# EAGLE design Layer3 (EAGLE 9.6.1)

## Sheet 1 of 2
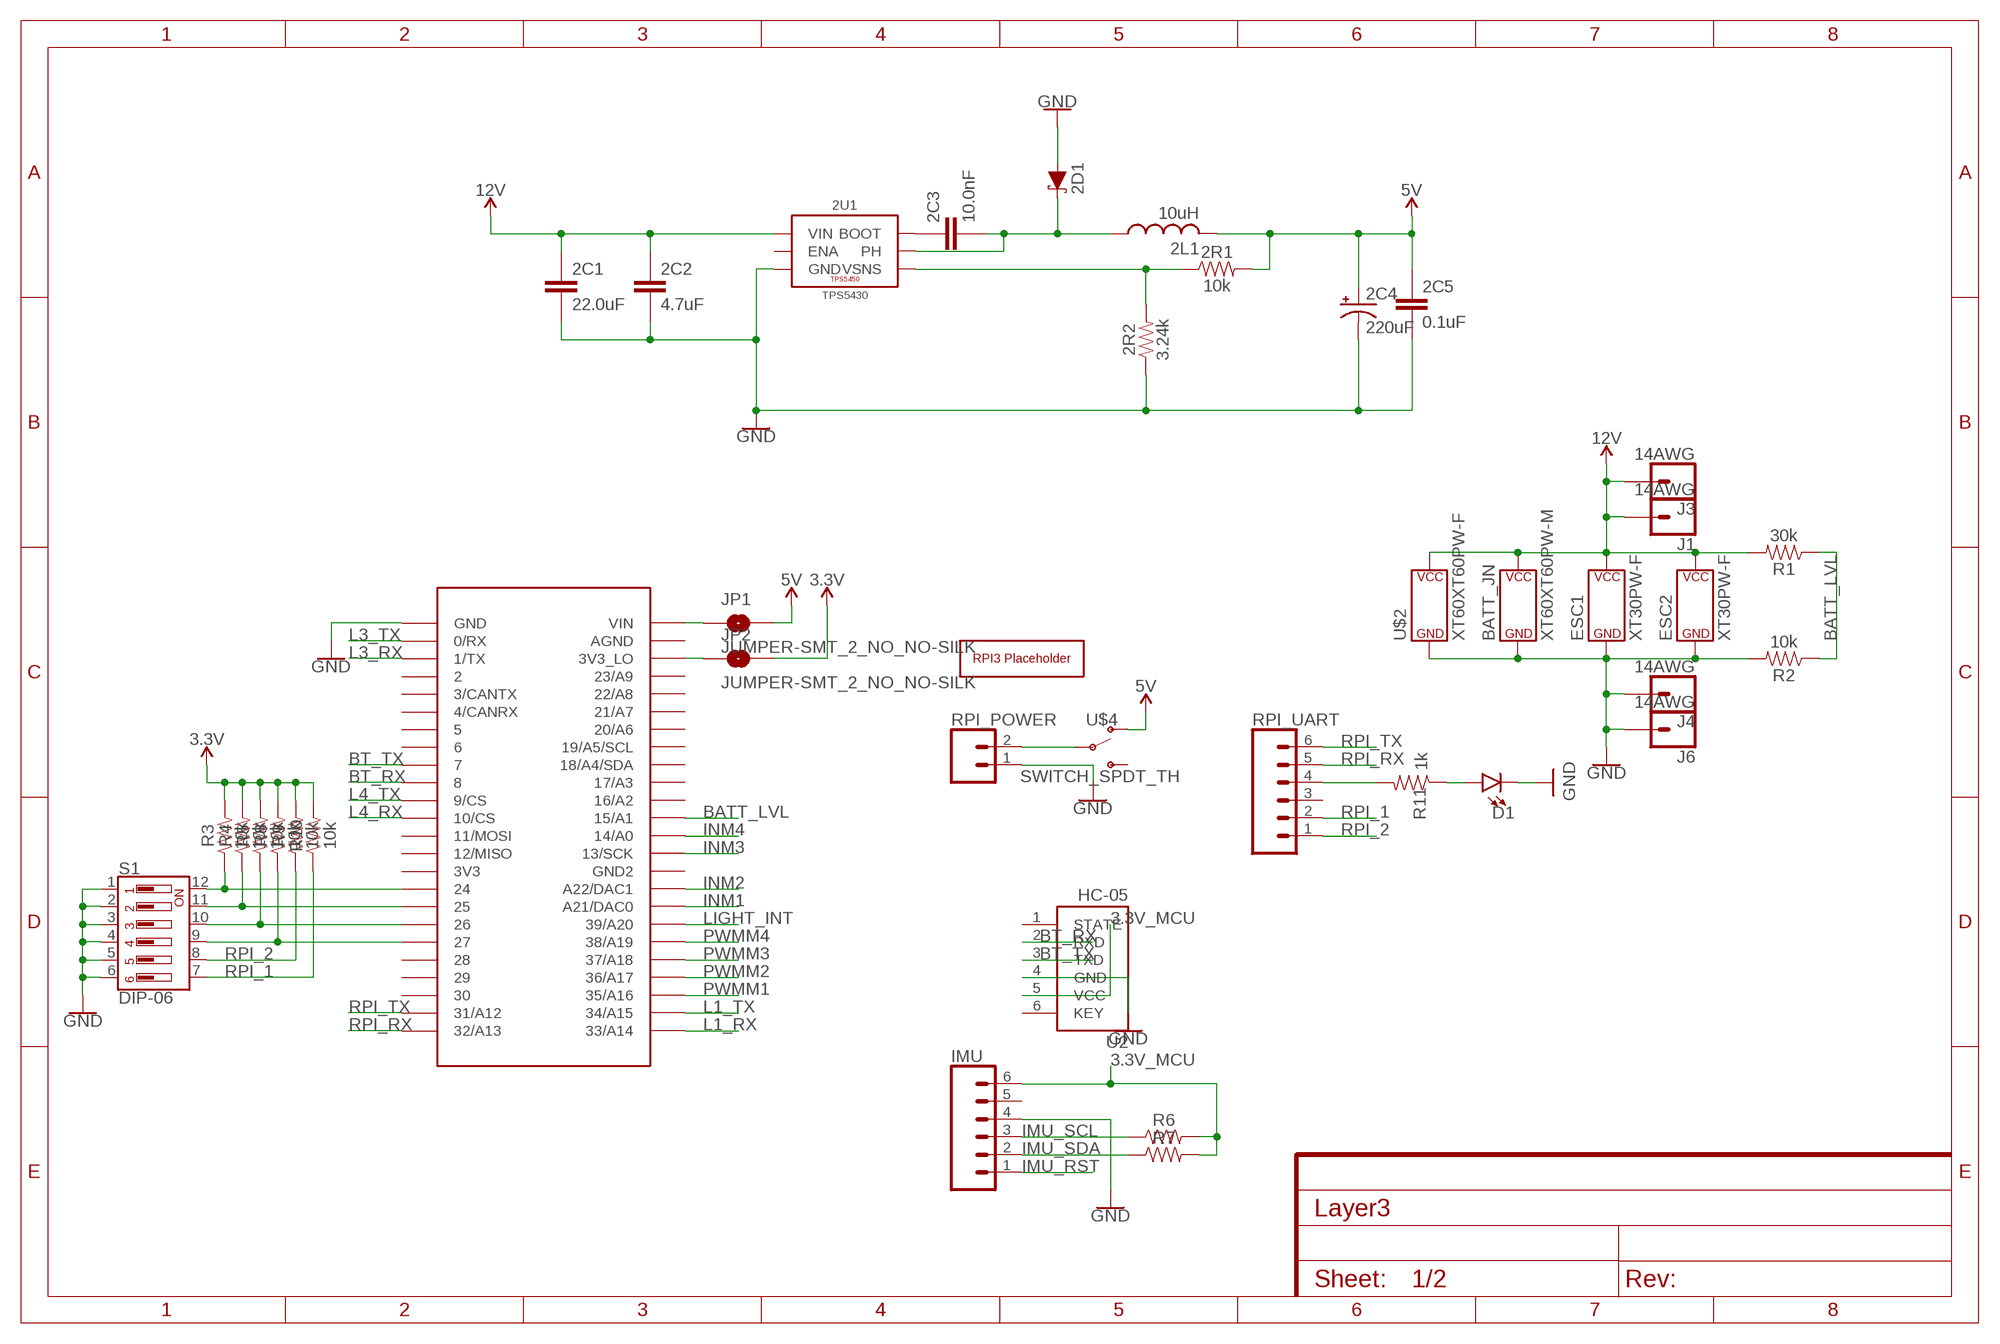
[diagram p0: schematic, sheet 1]

### Parts
2C1  22.0uF  CAPACITOR1210  [C1210]
2C2  4.7uF  CAPACITOR0603  [C0603]
2C3  10.0nF  CAPACITOR0603  [C0603]
2C4  220uF  CPOL-USD/7343-31R  [D/7343-31R]
2C5  0.1uF  CAPACITOR0603  [C0603]
2D1  3A/40V/500mV  DIODE-SCHOTTKY  [SMA-DIODE]
2L1  10uH  INDUCTORSWPA8040  [SWPA8040]
2R1  10k  RESISTOR0603  [R0603]
2R2  3.24k  RESISTOR0603  [R0603]
2U1  TPS5430  TPS5450  [POWERPAD-SOIC-8]
BATT_JN  XT60XT60PW-M  [XT60PW-M]
D1  BLUE  LED0603  [LED-0603]
ESC1  XT30PW-F  [XT30PW-F]
ESC2  XT30PW-F  [XT30PW-F]
IMU  CONN_06FEMALE_LOCK  [1X06_FEMALE_LOCK.010]
J1  14AWG  [14AWG]
J3  14AWG  [14AWG]
J4  14AWG  [14AWG]
J6  14AWG  [14AWG]
JP1  JUMPER-SMT_2_NO_NO-SILK  [SMT-JUMPER_2_NO_NO-SILK]
JP2  JUMPER-SMT_2_NO_NO-SILK  [SMT-JUMPER_2_NO_NO-SILK]
PCB1  RPI3  [RPI3]
R1  30k  RESISTOR0603  [R0603]
R2  10k  RESISTOR0603  [R0603]
R3  10k  RESISTOR0603  [R0603]
R4  10k  RESISTOR0603  [R0603]
R5  10k  RESISTOR0603  [R0603]
R6  RESISTOR0603  [R0603]
R7  RESISTOR0603  [R0603]
R8  10k  RESISTOR0603  [R0603]
R9  10k  RESISTOR0603  [R0603]
R10  10k  RESISTOR0603  [R0603]
R11  1k  RESISTOR0603  [R0603]
RPI_POWER  CONN_02LOCK  [1X02_LOCK]
RPI_UART  CONN_06LOCK  [1X06_LOCK]
S1  DIP-06  [DIPSWITCH-06-SMD]
U2  HC-05_BENT  [HC-05_BENT]
U$1  TEENSY_3.5/3.6_NO_MIDDLE  [TEENSY_3.5/3.6_NO_MIDDLE]
U$2  XT60XT60PW-F  [XT60PW-F]
U$4  SWITCH_SPDT_TH  [SWITCH_SPDT_PTH_11.6X4.0MM_LOCK]

### Nets
3.3V: JP2.2 R3.2 R4.2 R5.2 R8.2 R9.2 R10.2 ; also sheet 2
3.3V_MCU: IMU.6 R6.2 R7.2 U2.5(VCC) ; also sheet 2
5V: 2C4.+ 2C5.1 2L1.P2 2R1.2 JP1.2 U$4.1(O) ; also sheet 2
12V: 2C1.1 2C2.1 2U1.7(VIN) BATT_JN.+(P$V+) ESC1.+(P$V+) ESC2.+(P$V+) J1.P$1 J3.P$1 R1.2 U$2.+(P$V+)
BATT_LVL: R1.1 R2.1 U$1.15/A1
BT_RX: U2.2(RXD) U$1.8
BT_TX: U2.3(TXD) U$1.7
GND: 2C1.2 2C2.2 2C4.- 2C5.2 2D1.A 2R2.1 2U1.6(GND) 2U1.9(GND) 2U1.P$1(GND) 2U1.P$2(GND) 2U1.P$3(GND) 2U1.P$4(GND) 2U1.P$5(GND) 2U1.P$6(GND) BATT_JN.-(P$V-) D1.C ESC1.-(P$V-) ESC2.-(P$V-) IMU.4 J4.P$1 J6.P$1 R2.2 RPI_POWER.1 S1.1 S1.2 S1.3 S1.4 S1.5 S1.6 U2.4(GND) U$1.GND U$2.-(P$V-) ; also sheet 2
IMU_RST: IMU.1 ; also sheet 2
IMU_SCL: IMU.3 R6.1 ; also sheet 2
IMU_SDA: IMU.2 R7.1 ; also sheet 2
INM1: U$1.A21/DAC0 ; also sheet 2
INM2: U$1.A22/DAC1 ; also sheet 2
INM3: U$1.13/SCK ; also sheet 2
INM4: U$1.14/A0 ; also sheet 2
L1_RX: U$1.33/A14 ; also sheet 2
L1_TX: U$1.34/A15 ; also sheet 2
L3_RX: U$1.1/TX ; also sheet 2
L3_TX: U$1.0/RX ; also sheet 2
L4_RX: U$1.10/CS ; also sheet 2
L4_TX: U$1.9/CS ; also sheet 2
LIGHT_INT: U$1.39/A20 ; also sheet 2
N$1: JP1.1 U$1.VIN
N$2: JP2.1 U$1.3V3_LO
N$5: R4.1 S1.11 U$1.25
N$6: 2C3.2 2D1.C 2L1.P1 2U1.8(PH)
N$7: 2R1.1 2R2.2 2U1.4(VSNS)
N$8: 2C3.1 2U1.1(BOOT)
N$9: RPI_POWER.2 U$4.2(P)
N$10: R3.1 S1.12 U$1.24
N$11: R5.1 S1.10 U$1.26
N$12: R8.1 S1.9 U$1.27
N$13: R11.2 RPI_UART.4
N$14: D1.A R11.1
PWMM1: U$1.35/A16 ; also sheet 2
PWMM2: U$1.36/A17 ; also sheet 2
PWMM3: U$1.37/A18 ; also sheet 2
PWMM4: U$1.38/A19 ; also sheet 2
RPI_1: R10.1 RPI_UART.2 S1.7
RPI_2: R9.1 RPI_UART.1 S1.8
RPI_RX: RPI_UART.5 U$1.32/A13
RPI_TX: RPI_UART.6 U$1.31/A12
Unconnected: 2U1.2(NC) 2U1.3(NC) 2U1.5(ENA) IMU.5 RPI_UART.3 U2.1(STATE) U2.6(KEY) U$1.2 U$1.3/CANTX U$1.3V3 U$1.4/CANRX U$1.5 U$1.6 U$1.11/MOSI U$1.12/MISO U$1.16/A2 U$1.17/A3 U$1.18/A4/SDA U$1.19/A5/SCL U$1.20/A6 U$1.21/A7 U$1.22/A8 U$1.23/A9 U$1.28 U$1.29 U$1.30 U$1.AGND U$1.GND2 U$4.3(S)

## Sheet 2 of 2
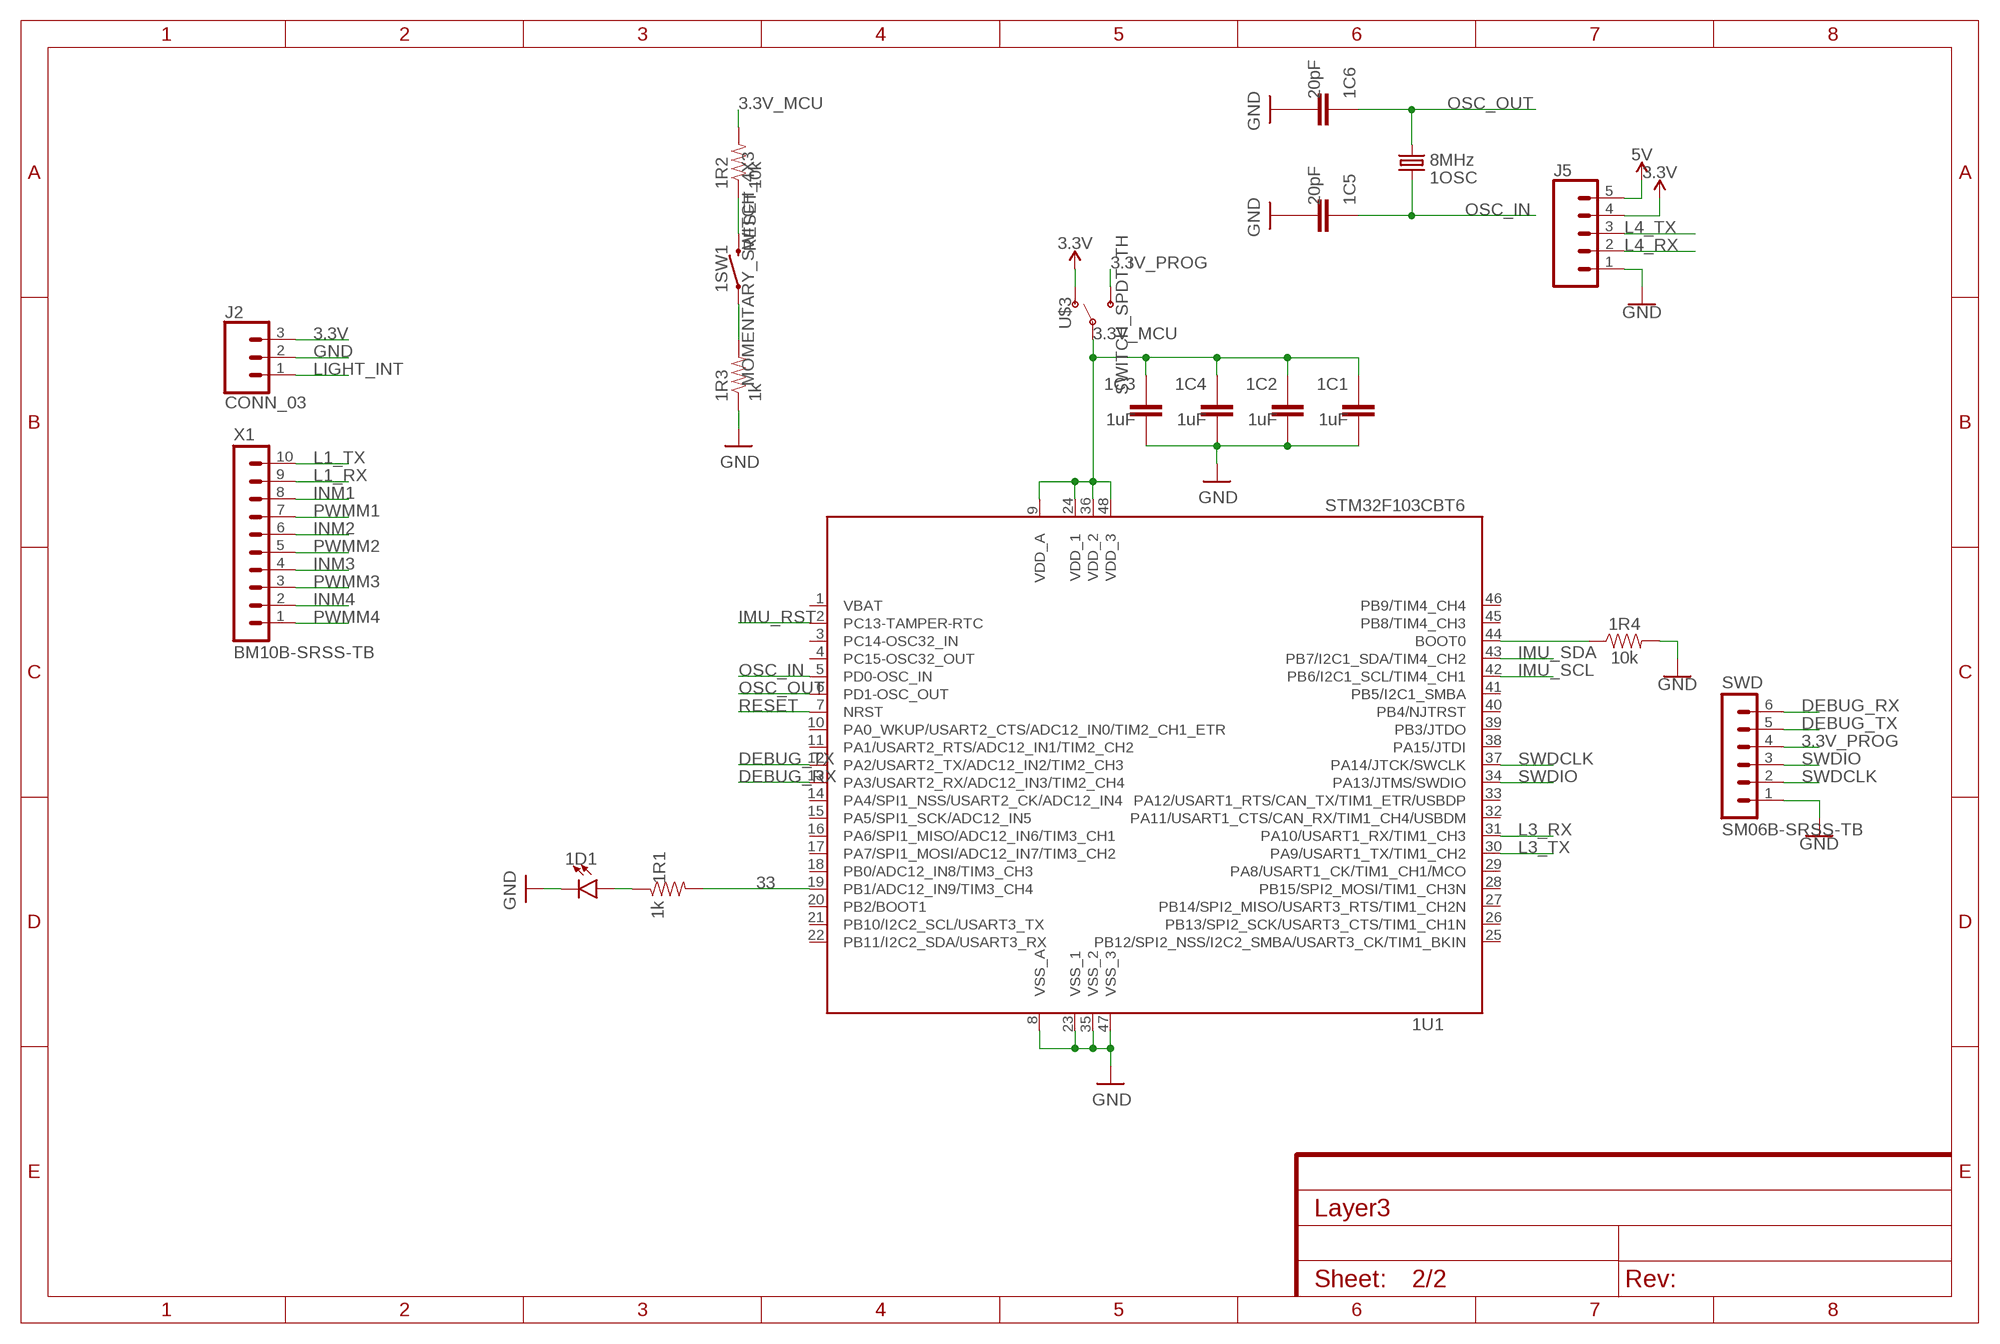
[diagram p1: schematic, sheet 2]

### Parts
1C1  1uF  CAPACITOR0603  [C0603]
1C2  1uF  CAPACITOR0603  [C0603]
1C3  1uF  CAPACITOR0603  [C0603]
1C4  1uF  CAPACITOR0603  [C0603]
1C5  20pF  CAPACITOR0603  [C0603]
1C6  20pF  CAPACITOR0603  [C0603]
1D1  BLUE  LED0603  [LED-0603]
1OSC  8MHz  CRYSTAL_5032  [CRYSTAL-SMD-5X3.2-2PAD]
1R1  1k  RESISTOR0603  [R0603]
1R2  10k  RESISTOR0603  [R0603]
1R3  1k  RESISTOR0603  [R0603]
1R4  10k  RESISTOR0603  [R0603]
1SW1  MOMENTARY_SWITCH_4X3  [MOMENTARY_SWITCH_4X3]
1U1  STM32F103CBT6  [LQFP48]
J2  CONN_03  [1X03_LOCK]
J5  CONN_05LOCK  [1X05_LOCK]
SWD  SM06B-SRSS-TB  [SM06B-SRSS-TB]
U$3  SWITCH_SPDT_TH  [SWITCH_SPDT_PTH_11.6X4.0MM_LOCK]
X1  BM10B-SRSS-TB  [BM10B-SRSS-TB]

### Nets
3.3V: J2.3 J5.4 U$3.1(O) ; also sheet 1
3.3V_MCU: 1C1.1 1C2.1 1C3.1 1C4.1 1R2.2 1U1.9(VDD_A) 1U1.24(VDD_1) 1U1.36(VDD_2) 1U1.48(VDD_3) U$3.2(P) ; also sheet 1
3.3V_PROG: SWD.4 U$3.3(S)
5V: J5.5 ; also sheet 1
33: 1R1.2 1U1.19(PB1/ADC12_IN9/TIM3_CH4)
DEBUG_RX: 1U1.13(PA3/USART2_RX/ADC12_IN3/TIM2_CH4) SWD.6
DEBUG_TX: 1U1.12(PA2/USART2_TX/ADC12_IN2/TIM2_CH3) SWD.5
GND: 1C1.2 1C2.2 1C3.2 1C4.2 1C5.2 1C6.2 1D1.C 1R3.1 1R4.2 1U1.8(VSS_A) 1U1.23(VSS_1) 1U1.35(VSS_2) 1U1.47(VSS_3) J2.2 J5.1 SWD.1 ; also sheet 1
IMU_RST: 1U1.2(PC13-TAMPER-RTC) ; also sheet 1
IMU_SCL: 1U1.42(PB6/I2C1_SCL/TIM4_CH1) ; also sheet 1
IMU_SDA: 1U1.43(PB7/I2C1_SDA/TIM4_CH2) ; also sheet 1
INM1: X1.8 ; also sheet 1
INM2: X1.6 ; also sheet 1
INM3: X1.4 ; also sheet 1
INM4: X1.2 ; also sheet 1
L1_RX: X1.9 ; also sheet 1
L1_TX: X1.10 ; also sheet 1
L3_RX: 1U1.31(PA10/USART1_RX/TIM1_CH3) ; also sheet 1
L3_TX: 1U1.30(PA9/USART1_TX/TIM1_CH2) ; also sheet 1
L4_RX: J5.2 ; also sheet 1
L4_TX: J5.3 ; also sheet 1
LIGHT_INT: J2.1 ; also sheet 1
N$3: 1D1.A 1R1.1
N$4: 1R3.2 1SW1.P$1
N$23: 1R4.1 1U1.44(BOOT0)
OSC_IN: 1C5.1 1OSC.P$2 1U1.5(PD0-OSC_IN)
OSC_OUT: 1C6.1 1OSC.P$1 1U1.6(PD1-OSC_OUT)
PWMM1: X1.7 ; also sheet 1
PWMM2: X1.5 ; also sheet 1
PWMM3: X1.3 ; also sheet 1
PWMM4: X1.1 ; also sheet 1
RESET: 1R2.1 1SW1.P$2 1U1.7(NRST)
SWDCLK: 1U1.37(PA14/JTCK/SWCLK) SWD.2
SWDIO: 1U1.34(PA13/JTMS/SWDIO) SWD.3
Unconnected: 1U1.3(PC14-OSC32_IN) 1U1.4(PC15-OSC32_OUT) 1U1.10(PA0_WKUP/USART2_CTS/ADC12_IN0/TIM2_CH1_ETR) 1U1.11(PA1/USART2_RTS/ADC12_IN1/TIM2_CH2) 1U1.14(PA4/SPI1_NSS/USART2_CK/ADC12_IN4) 1U1.15(PA5/SPI1_SCK/ADC12_IN5) 1U1.16(PA6/SPI1_MISO/ADC12_IN6/TIM3_CH1) 1U1.17(PA7/SPI1_MOSI/ADC12_IN7/TIM3_CH2) 1U1.18(PB0/ADC12_IN8/TIM3_CH3) 1U1.20(PB2/BOOT1) 1U1.21(PB10/I2C2_SCL/USART3_TX) 1U1.22(PB11/I2C2_SDA/USART3_RX) 1U1.25(PB12/SPI2_NSS/I2C2_SMBA/USART3_CK/TIM1_BKIN) 1U1.26(PB13/SPI2_SCK/USART3_CTS/TIM1_CH1N) 1U1.27(PB14/SPI2_MISO/USART3_RTS/TIM1_CH2N) 1U1.28(PB15/SPI2_MOSI/TIM1_CH3N) 1U1.29(PA8/USART1_CK/TIM1_CH1/MCO) 1U1.32(PA11/USART1_CTS/CAN_RX/TIM1_CH4/USBDM) 1U1.33(PA12/USART1_RTS/CAN_TX/TIM1_ETR/USBDP) 1U1.38(PA15/JTDI) 1U1.39(PB3/JTDO) 1U1.40(PB4/NJTRST) 1U1.41(PB5/I2C1_SMBA) 1U1.45(PB8/TIM4_CH3) 1U1.46(PB9/TIM4_CH4)

## Power pins joined to a net without a drawn wire
VBAT: 1U1.1(VBAT)

## Library data of the parts
1C1-1C6 2C1-2C3 2C5 = JH:CAPACITOR
1D1 D1 = JH:LED: Blue SMD LED Used in manufacturing of various products at SparkFun Packages: 0603 - SMD 0603 package [Product Link] <http://www.digikey.com/product-detail/en/SMLE12BC7TT86/511-1589-2-ND/1641808> 1206 - SMD1206 package [Product Link] <http://www.digikey.com/product-detail/en/lite-on-inc/LTST-C150TBKT/160-1643-1-ND/573584> SparkFun Products: ESP8266 Thing-Dev Board <https://www.sparkfun.com/products/13711> RedBoard <https://www.sparkfun.com/products/12757>
1OSC = JH:CRYSTAL: Crystals (Generic) These are passive quartz crystals, which can be used as a clock source for a microcontroller. Crystal's are two-terminal devices. They require external "load" capacitors to generate an oscillating signal.
1R1-1R4 2R1 2R2 R1-R11 = JH:RESISTOR
1SW1 = JH:MOMENTARY_SWITCH_4X3
1U1 = JH:STM32F103CBT6
2C4 = rcl:CPOL-US: POLARIZED CAPACITOR, American symbol; SPICEPREFIX: C
2D1 = JH:DIODE-SCHOTTKY
2L1 = JH:INDUCTOR
2U1 = JH:TPS5450
BATT_JN U$2 = JH:XT60
ESC1 ESC2 = JH:XT30
IMU = SparkFun-Connectors:CONN_06: Multi connection point. Often used as Generic Header-pin footprint for 0.1 inch spaced/style header connections On any of the 0.1 inch spaced packages, you can populate with these: Break Away Headers - Straight <https://www.sparkfun.com/products/116> (PRT-00116) Break Away Male Headers - Right Angle <https://www.sparkfun.com/products/553> (PRT-00553) Female Headers <https://www.sparkfun.com/products/115> (PRT-00115) Break Away Headers - Machine Pin <https://www.sparkfun.com/products/117> (PRT-00117) Break Away Female Headers - Swiss Machine Pin <https://www.sparkfun.com/products/743> (PRT-00743) Arduino Stackable Header - 6 Pin <https://www.sparkfun.com/products/9280> (PRT-09280) For SCREWTERMINALS and SPRING TERMINALS visit here: Screw Terimnals on SparkFun.com <https://www.sparkfun.com/search/results?term=Screw+Terminals> (5mm/3.5mm/2.54mm spacing) This device is also useful as a general connection point to wire up your design to another part of your project. Our various solder wires solder well into these plated through hole pads. Hook-Up Wire - Assortment (Stranded, 22 AWG) <https://www.sparkfun.com/products/11375> (PRT-11375) Hook-Up Wire - Assortment (Solid Core, 22 AWG) <https://www.sparkfun.com/products/11367> (PRT-11367) View the entire wire category on our website here <https://www.sparkfun.com/categories/141>
J1 J3 J4 J6 = JH:14AWG
J2 = JH:CONN_03
J5 = Connectors:CONN_05: Multi connection point. Often used as Generic Header-pin footprint for 0.1 inch spaced/style header connections On any of the 0.1 inch spaced packages, you can populate with these: Break Away Headers - Straight <https://www.sparkfun.com/products/116> (PRT-00116) Break Away Male Headers - Right Angle <https://www.sparkfun.com/products/553> (PRT-00553) Female Headers <https://www.sparkfun.com/products/115> (PRT-00115) Break Away Headers - Machine Pin <https://www.sparkfun.com/products/117> (PRT-00117) Break Away Female Headers - Swiss Machine Pin <https://www.sparkfun.com/products/743> (PRT-00743) For SCREWTERMINALS and SPRING TERMINALS visit here: Screw Terimnals on SparkFun.com <https://www.sparkfun.com/search/results?term=Screw+Terminals> (5mm/3.5mm/2.54mm spacing) This device is also useful as a general connection point to wire up your design to another part of your project. Our various solder wires solder well into these plated through hole pads. Hook-Up Wire - Assortment (Stranded, 22 AWG) <https://www.sparkfun.com/products/11375> (PRT-11375) Hook-Up Wire - Assortment (Solid Core, 22 AWG) <https://www.sparkfun.com/products/11367> (PRT-11367) View the entire wire category on our website here <https://www.sparkfun.com/categories/141> Special notes: Molex polarized connector foot print use with SKU : PRT-08231 with associated crimp pins and housings. 1MM SMD Version SKU: PRT-10208
JP1 JP2 = SparkFun-Jumpers:JUMPER-SMT_2_NO: Normally open jumper This jumper has two pads in close proximity to each other. Apply solder to close the connection. Round pads are easier to solder for beginners, but are a lot larger. SparkFun Product that uses the round pads: SparkFun EL Sequencer <https://www.sparkfun.com/products/12781>
PCB1 = JH:RPI3: Device for Raspberry Pi 3 board created by Dave Young for www.element14.com More information and support community is available at https://www.element14.com/community/community/raspberry-pi
RPI_POWER = Connectors:CONN_02: Multi connection point. Often used as Generic Header-pin footprint for 0.1 inch spaced/style header connections On any of the 0.1 inch spaced packages, you can populate with these: Break Away Headers - Straight <https://www.sparkfun.com/products/116> (PRT-00116) Break Away Male Headers - Right Angle <https://www.sparkfun.com/products/553> (PRT-00553) Female Headers <https://www.sparkfun.com/products/115> (PRT-00115) Break Away Headers - Machine Pin <https://www.sparkfun.com/products/117> (PRT-00117) Break Away Female Headers - Swiss Machine Pin <https://www.sparkfun.com/products/743> (PRT-00743) For SCREWTERMINALS and SPRING TERMINALS visit here: Screw Terimnals on SparkFun.com <https://www.sparkfun.com/search/results?term=Screw+Terminals> (5mm/3.5mm/2.54mm spacing) This device is also useful as a general connection point to wire up your design to another part of your project. Our various solder wires solder well into these plated through hole pads. Hook-Up Wire - Assortment (Stranded, 22 AWG) <https://www.sparkfun.com/products/11375> (PRT-11375) Hook-Up Wire - Assortment (Solid Core, 22 AWG) <https://www.sparkfun.com/products/11367> (PRT-11367) View the entire wire category on our website here <https://www.sparkfun.com/categories/141> Special notes: Molex polarized connector foot print use with: PRT-08233 with associated crimp pins and housings. 2.54_SCREWTERM for use with PRT-10571. 3.5mm Screw Terminal footprints for PRT-08084 5mm Screw Terminal footprints for use with PRT-08432
RPI_UART = Connectors:CONN_06: Multi connection point. Often used as Generic Header-pin footprint for 0.1 inch spaced/style header connections On any of the 0.1 inch spaced packages, you can populate with these: Break Away Headers - Straight <https://www.sparkfun.com/products/116> (PRT-00116) Break Away Male Headers - Right Angle <https://www.sparkfun.com/products/553> (PRT-00553) Female Headers <https://www.sparkfun.com/products/115> (PRT-00115) Break Away Headers - Machine Pin <https://www.sparkfun.com/products/117> (PRT-00117) Break Away Female Headers - Swiss Machine Pin <https://www.sparkfun.com/products/743> (PRT-00743) Arduino Stackable Header - 6 Pin <https://www.sparkfun.com/products/9280> (PRT-09280) For SCREWTERMINALS and SPRING TERMINALS visit here: Screw Terimnals on SparkFun.com <https://www.sparkfun.com/search/results?term=Screw+Terminals> (5mm/3.5mm/2.54mm spacing) This device is also useful as a general connection point to wire up your design to another part of your project. Our various solder wires solder well into these plated through hole pads. Hook-Up Wire - Assortment (Stranded, 22 AWG) <https://www.sparkfun.com/products/11375> (PRT-11375) Hook-Up Wire - Assortment (Solid Core, 22 AWG) <https://www.sparkfun.com/products/11367> (PRT-11367) View the entire wire category on our website here <https://www.sparkfun.com/categories/141>
S1 = JH:DIP-06; PROD_ID: --------
SWD = con-JST SH:SM06B-SRSS: JST SH series header 1.00mm pitch disconnectable crimp style connectors, horizontal (side entry type), 6 pins
U2 = JH:HC-05
U$1 = JH:TEENSY_3.5/3.6_NO_MIDDLE
U$3 U$4 = JH:SWITCH_SPDT
X1 = con-JST SH:BM10B-SRSS: JST SH series header 1.00mm pitch disconnectable crimp style connectors, vertical (side entry type), 10 pins

## Board
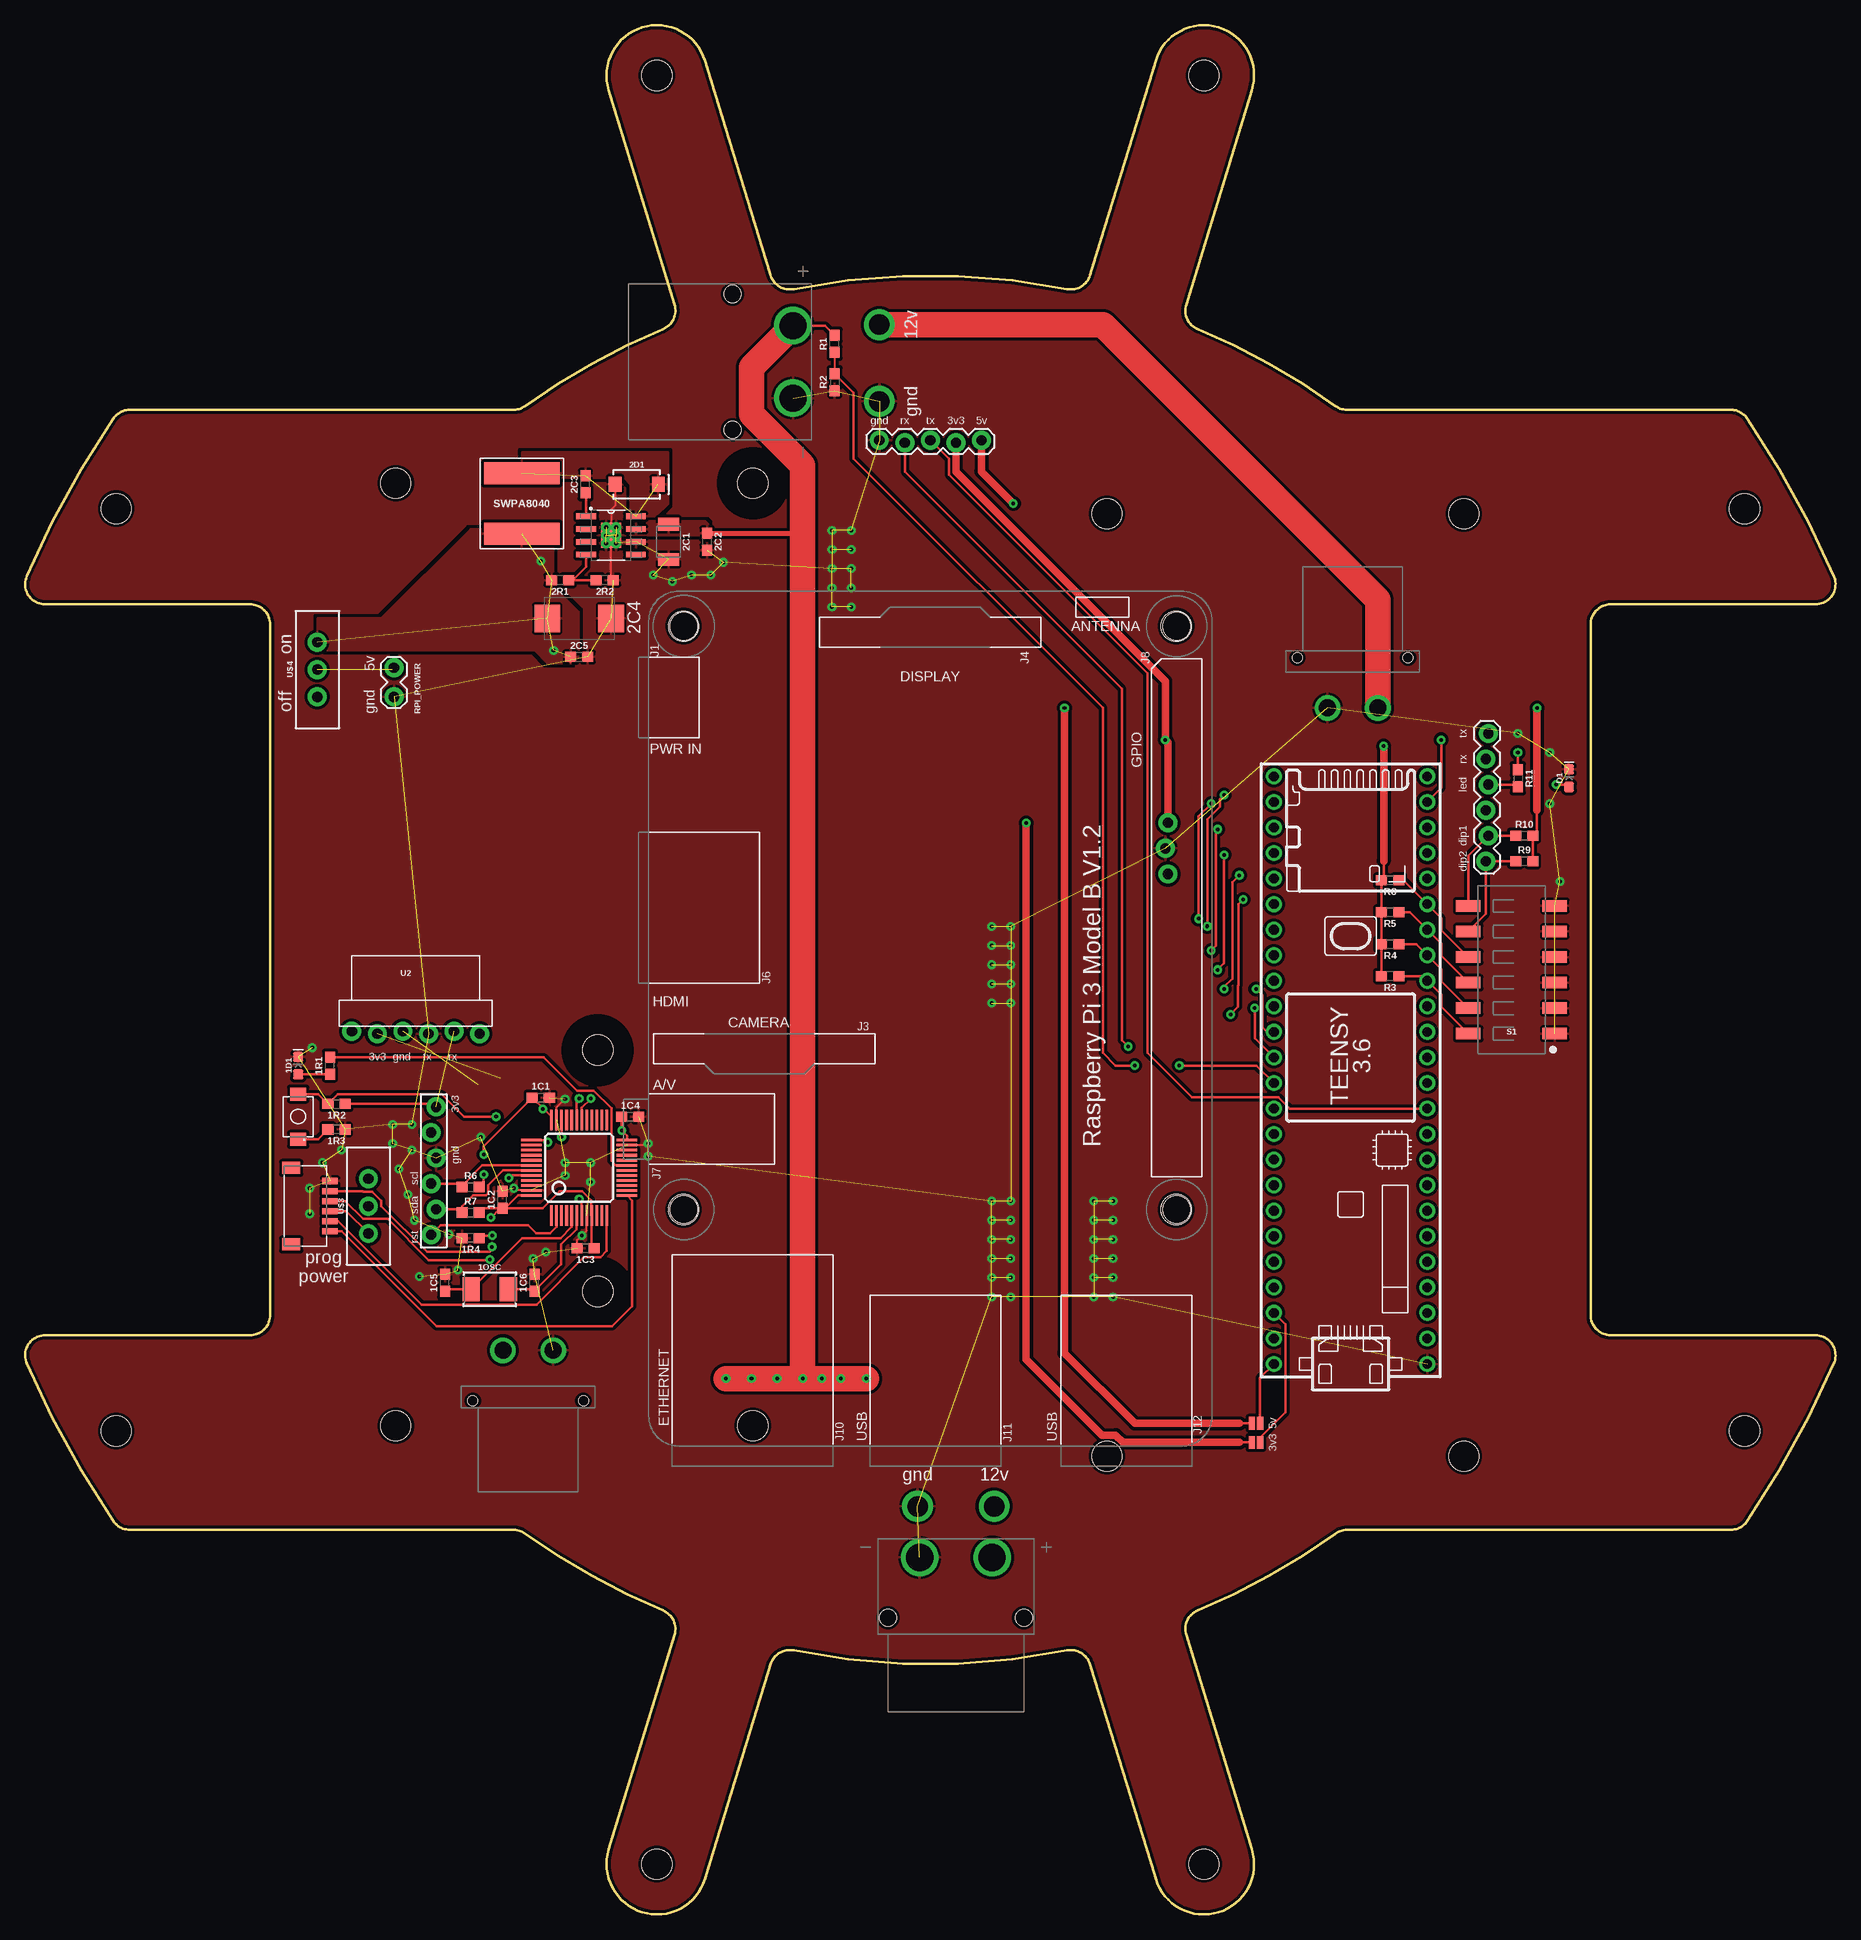
[diagram p2: board, top side]
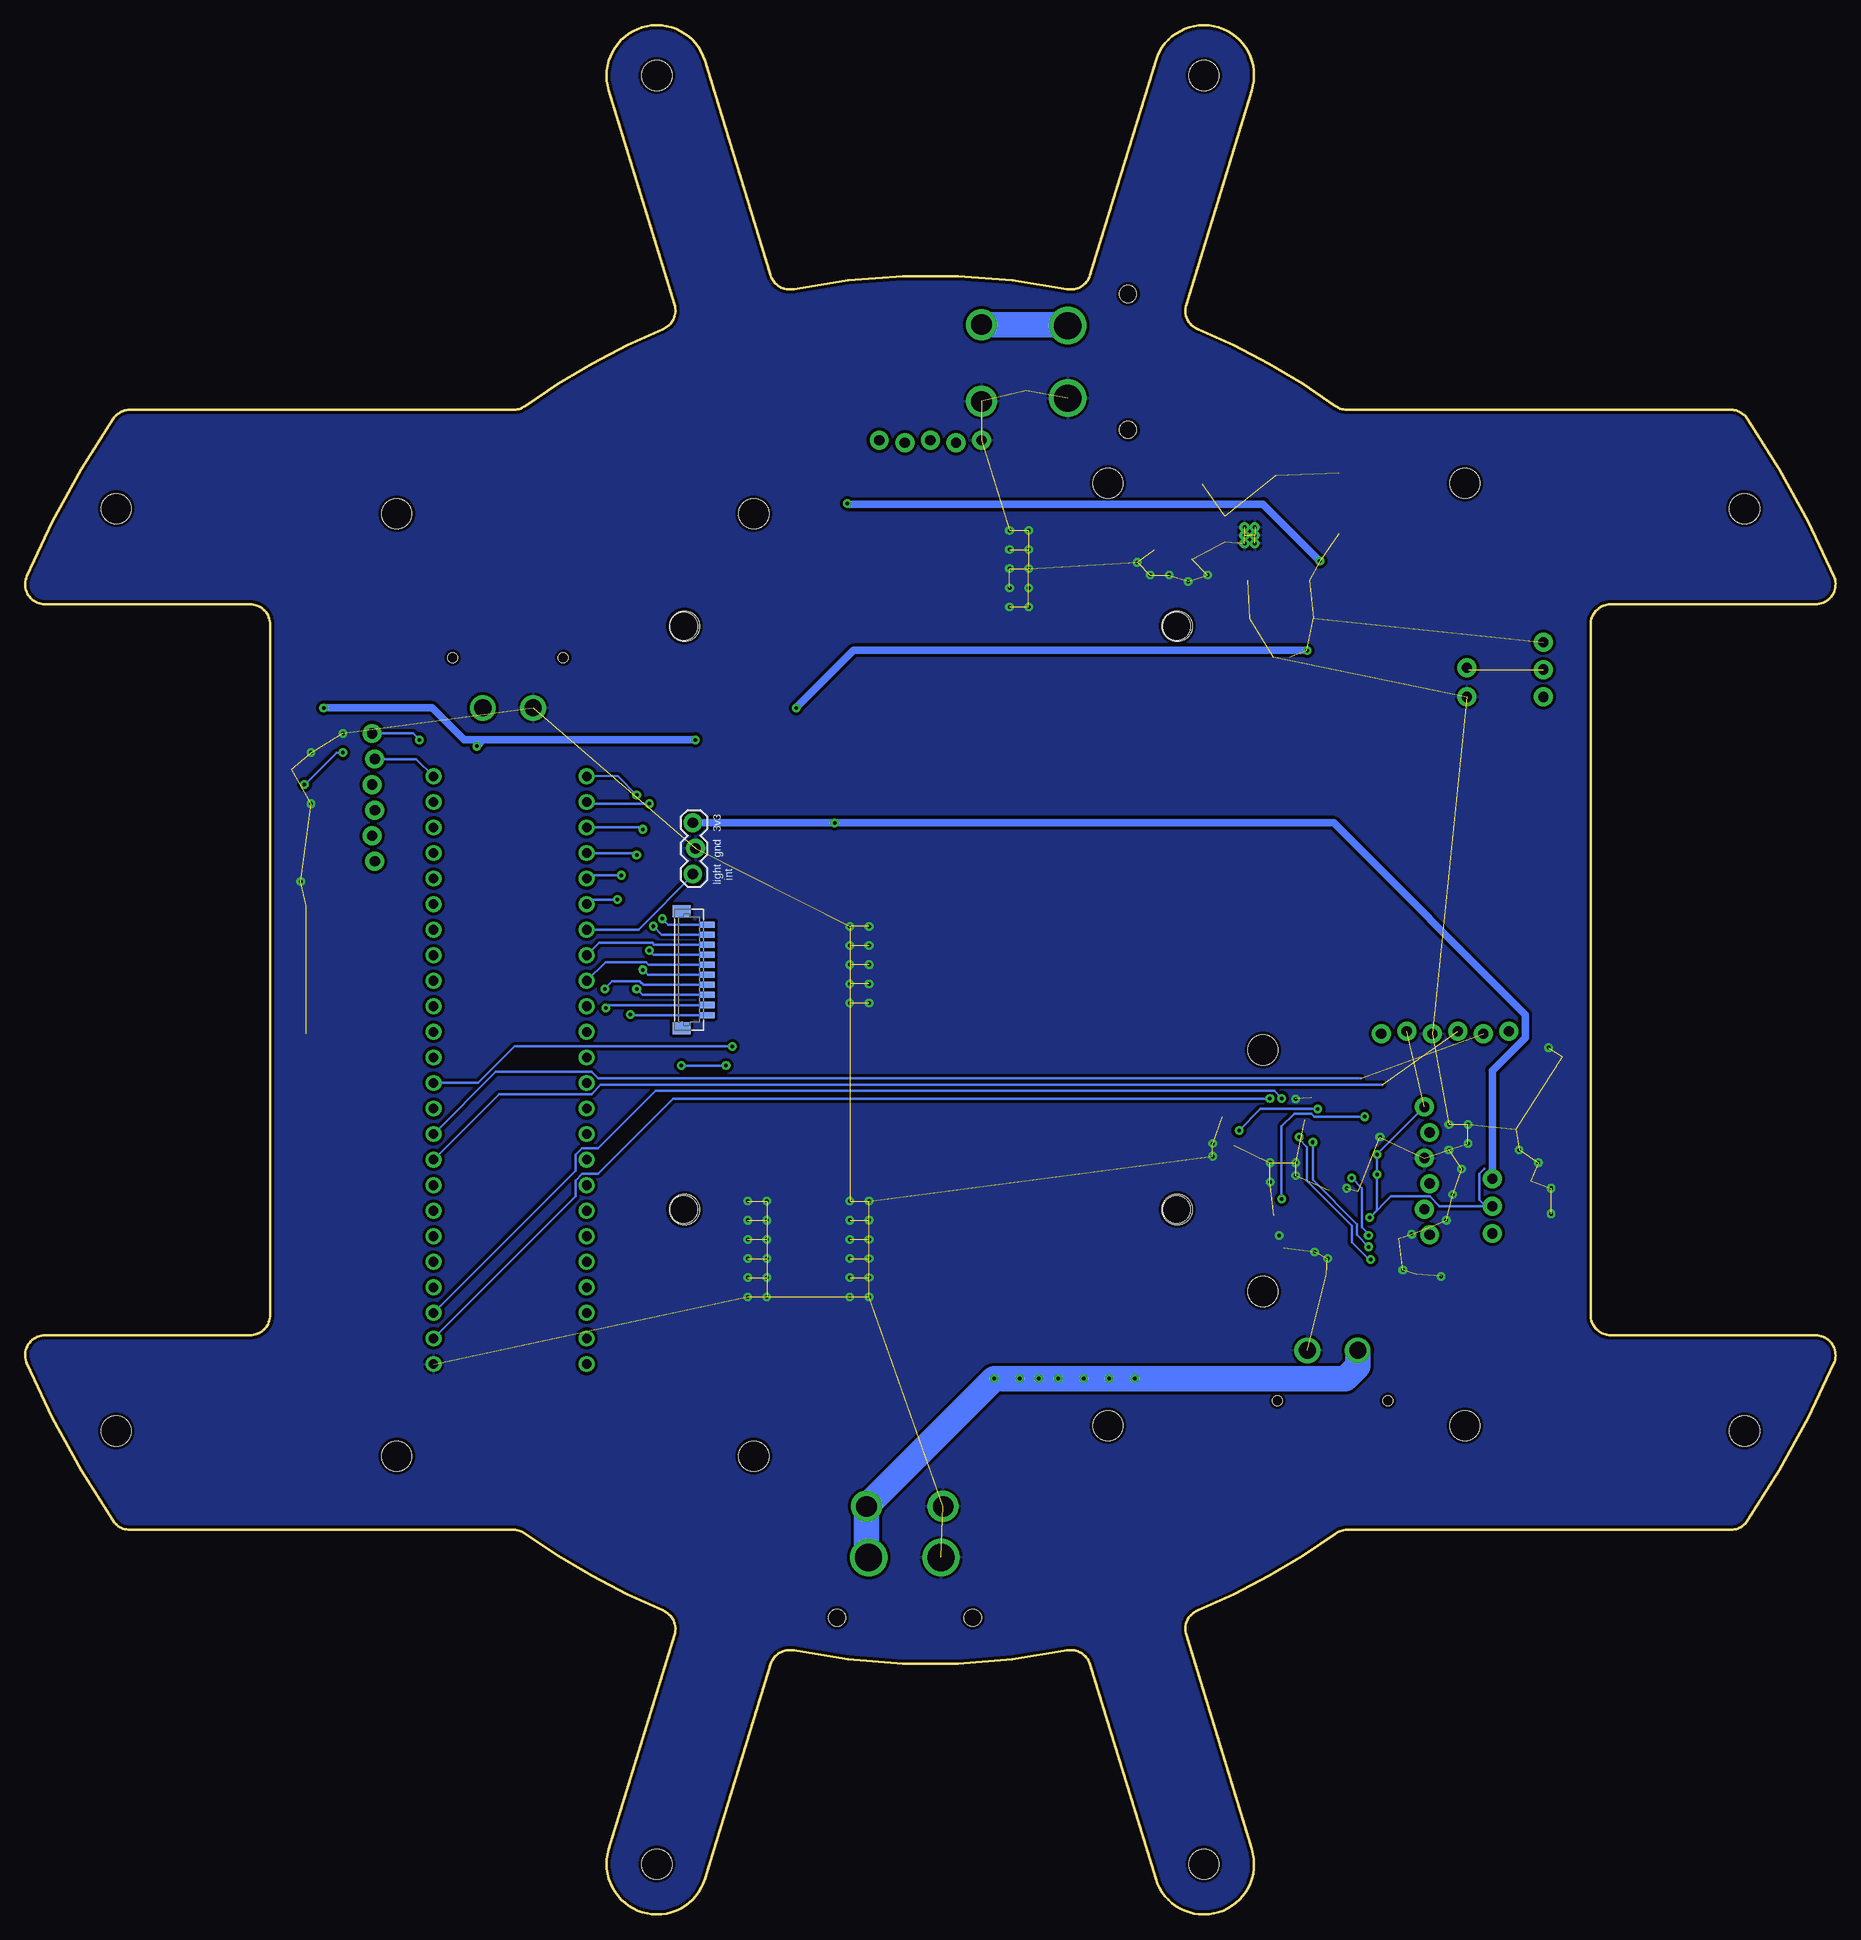
[diagram p3: board, bottom side, seen from below]

Size 180.03 x 187.82 mm. Coordinates in mm from the lower left corner, seen from the top.
Outline: 115.46,160.04 121.99,181.36 arc180 112.43,184.29 105.9,162.96 arc-84 103.59,161.58 arc23 76.44,161.58 arc-84 74.14,162.96 67.6,184.29 arc180 58.04,181.36 64.57,160.04 arc-84 63.43,157.6 arc13 49.74,149.96 arc-36 48.57,149.58 10.42,149.58 arc56 8.76,148.7 arc10 0.17,133.04 arc114 2,130.24 22.36,130.24 arc-90 24.36,128.24 24.36,59.58 arc-90 22.36,57.58 2,57.58 arc114 0.17,54.78 arc10 8.76,39.12 arc56 10.42,38.24 48.57,38.24 arc-36 49.74,37.86 arc13 63.43,30.22 arc-84 64.57,27.79 58.04,6.47 arc180 67.6,3.54 74.14,24.87 arc-84 76.44,26.24 arc23 103.59,26.24 arc-84 105.9,24.87 112.43,3.54 arc180 121.99,6.47 115.46,27.79 arc-84 116.6,30.22 arc13 130.29,37.86 arc-36 131.46,38.24 169.61,38.24 arc56 171.27,39.12 arc10 179.86,54.78 arc114 178.03,57.58 157.68,57.58 arc-90 155.68,59.58 155.68,128.24 arc-90 157.68,130.24 178.03,130.24 arc114 179.86,133.04 arc10 171.27,148.7 arc56 169.61,149.58 131.46,149.58 arc-36 130.29,149.96 arc13 116.6,157.6 arc-84 115.46,160.04
Copper layers (1*16): Top 0.035mm / dielectric 1.5mm / Bottom 0.035mm
Design rules "mine": minimum track width 8mil, minimum drill 10mil, track to track 8mil, track to pad 8mil, pad to pad 8mil, via to via 8mil, smd to smd 8mil, copper to edge 8mil, drill to drill 8mil, minimum pad ring 12mil, minimum via ring 10mil, stop-mask expansion 4mil, vias tented up to drill 25mil, thermal gap 10mil
Holes 3 mm at 65.47,70.08 9.06,139.76 72.36,48.58 9.06,48.06 36.86,48.58 36.86,142.28 65.47,128.08 72.36,142.28 107.58,45.56 62.82,182.82 143.08,45.56 114.47,70.08 143.08,139.26 170.97,139.76 62.82,5 56.96,61.93 56.96,85.93 117.21,182.82 117.21,5 170.97,48.06 107.58,139.26 114.47,128.08
tRestrict: area 69.2,139.1 to 75.6,145.5; area 53.7,58.7 to 60.1,65.1; area 53.7,82.7 to 60.1,89.1

### Footprints (pad centres in the part's own frame; a part is rotated, then mirrored left to right if it is on the bottom)
C0603 = smd 1.1 x 1: 1 -0.85,0; 2 0.85,0
LED-0603 = smd 1 x 1: A -0.877,0; C 0.877,0
CRYSTAL-SMD-5X3.2-2PAD = smd 1.7 x 2.4: P$1 1.85,0; P$2 -1.85,0
R0603 = smd 1.1 x 1: 1 -0.85,0; 2 0.85,0
MOMENTARY_SWITCH_4X3 = smd 1.3 x 1.6: P$1 -2.25,0; P$2 2.25,0
LQFP48 = smd 0.254 x 2.032: 1 -2.75,-4.758; 2 -2.25,-4.758; 3 -1.75,-4.758; 4 -1.25,-4.758; 5 -0.75,-4.758; 6 -0.25,-4.758; 7 0.25,-4.758; 8 0.75,-4.758; 9 1.25,-4.758; 10 1.75,-4.758; 11 2.25,-4.758; 12 2.75,-4.758; 25 2.75,4.758; 26 2.25,4.758; 27 1.75,4.758; 28 1.25,4.758; 29 0.75,4.758; 30 0.25,4.758; 31 -0.25,4.758; 32 -0.75,4.758; 33 -1.25,4.758; 34 -1.75,4.758; 35 -2.25,4.758; 36 -2.75,4.758 | smd 2.032 x 0.254: 13 4.758,-2.75; 14 4.758,-2.25; 15 4.758,-1.75; 16 4.758,-1.25; 17 4.758,-0.75; 18 4.758,-0.25; 19 4.758,0.25; 20 4.758,0.75; 21 4.758,1.25; 22 4.758,1.75; 23 4.758,2.25; 24 4.758,2.75; 37 -4.758,2.75; 38 -4.758,2.25; 39 -4.758,1.75; 40 -4.758,1.25; 41 -4.758,0.75; 42 -4.758,0.25; 43 -4.758,-0.25; 44 -4.758,-0.75; 45 -4.758,-1.25; 46 -4.758,-1.75; 47 -4.758,-2.25; 48 -4.758,-2.75
C1210 = smd 1.27 x 2.06: 1 -1.755,0; 2 1.755,0
D/7343-31R = smd 2.55 x 2.7: + 3.175,0; - -3.175,0
SMA-DIODE = smd 1.27 x 1.47: A -2.15,0; C 2.15,0
SWPA8040 = smd 2.2 x 7.5: P1 -3,0; P2 3,0
POWERPAD-SOIC-8 = smd 1.981 x 0.559: 1 -2.464,1.905; 2 -2.464,0.635; 3 -2.464,-0.635; 4 -2.464,-1.905; 5 2.464,-1.905; 6 2.464,-0.635; 7 2.464,0.635; 8 2.464,1.905 | smd 2.007 x 2.489: 9 0,0 | drill 0.381: P$1 -0.5,0.8; P$2 0.5,0.8; P$3 -0.5,0; P$4 0.5,0; P$5 -0.5,-0.8; P$6 0.5,-0.8
XT60PW-M = drill 2.7: + -3.6,0; - 3.6,0 | hole 1.7: -6.75,-6; 6.75,-6
XT30PW-F = drill 1.7: + -2.5,0; - 2.5,0 | hole 1: -5.5,-5; 5.5,-5
1X06_FEMALE_LOCK.010 = drill 1.016 pad 1.88: 1 0,0.254; 2 2.54,-0.254; 3 5.08,0.254; 4 7.62,-0.254; 5 10.16,0.254; 6 12.7,-0.254
14AWG = drill 2.05: P$1 0,0
1X03_LOCK = drill 1.016 pad 1.88: 1 0,0.127; 2 2.54,-0.127; 3 5.08,0.127
1X05_LOCK = drill 1.016 pad 1.88: 1 0,0.127; 2 2.54,-0.127; 3 5.08,0.127; 4 7.62,-0.127; 5 10.16,0.127
SMT-JUMPER_2_NO_NO-SILK = smd 0.635 x 1.27: 1 -0.406,0; 2 0.406,0
RPI3 = hole 2.75: 3.5,3.5; 61.5,3.5; 3.5,52.5; 61.5,52.5
1X02_LOCK = drill 1.016 pad 1.88: 1 -0.178,0; 2 2.718,0
1X06_LOCK = drill 1.016 pad 1.88: 1 0,0; 2 2.54,-0.254; 3 5.08,0; 4 7.62,-0.254; 5 10.16,0; 6 12.7,-0.254
DIPSWITCH-06-SMD = smd 1.13 x 2.44: 1 -6.35,-4.3; 2 -3.81,-4.3; 3 -1.27,-4.3; 4 1.27,-4.3; 5 3.81,-4.3; 6 6.35,-4.3; 7 6.35,4.3; 8 3.81,4.3; 9 1.27,4.3; 10 -1.27,4.3; 11 -3.81,4.3; 12 -6.35,4.3
SM06B-SRSS-TB = smd 0.6 x 1.55: 1 2.5,0; 2 1.5,0; 3 0.5,0; 4 -0.5,0; 5 -1.5,0; 6 -2.5,0 | smd 1.2 x 1.8: M1 3.8,3.875; M2 -3.8,3.875
HC-05_BENT = drill 1.016 pad 1.88: 1 0,0.127; 2 2.54,-0.127; 3 5.08,0.127; 4 7.62,-0.127; 5 10.16,0.127; 6 12.7,-0.127
TEENSY_3.5/3.6_NO_MIDDLE = drill 0.965: 0/RX -25.4,-7.62; 1/TX -22.86,-7.62; 2 -20.32,-7.62; 3/CANTX -17.78,-7.62; 3V3 7.62,-7.62; 3V3_LO -22.86,7.62; 4/CANRX -15.24,-7.62; 5 -12.7,-7.62; 6 -10.16,-7.62; 7 -7.62,-7.62; 8 -5.08,-7.62; 9/CS -2.54,-7.62; 10/CS 0,-7.62; 11/MOSI 2.54,-7.62; 12/MISO 5.08,-7.62; 13/SCK 5.08,7.62; 14/A0 2.54,7.62; 15/A1 0,7.62; 16/A2 -2.54,7.62; 17/A3 -5.08,7.62; 18/A4/SDA -7.62,7.62; 19/A5/SCL -10.16,7.62; 20/A6 -12.7,7.62; 21/A7 -15.24,7.62; 22/A8 -17.78,7.62; 23/A9 -20.32,7.62; 24 10.16,-7.62; 25 12.7,-7.62; 26 15.24,-7.62; 27 17.78,-7.62; 28 20.32,-7.62; 29 22.86,-7.62; 30 25.4,-7.62; 31/A12 27.94,-7.62; 32/A13 30.48,-7.62; 33/A14 30.48,7.62; 34/A15 27.94,7.62; 35/A16 25.4,7.62; 36/A17 22.86,7.62; 37/A18 20.32,7.62; 38/A19 17.78,7.62; 39/A20 15.24,7.62; A21/DAC0 12.7,7.62; A22/DAC1 10.16,7.62; AGND -25.4,7.62; GND -27.94,-7.62; GND2 7.62,7.62; VIN -27.94,7.62
XT60PW-F = drill 2.7: + 3.6,0; - -3.6,0 | hole 1.7: -6.75,-6; 6.75,-6
SWITCH_SPDT_PTH_11.6X4.0MM_LOCK = drill 1.016 pad 1.88: 1 0,2.718; 2 0,0; 3 0,-2.718
BM10B-SRSS-TB = smd 0.6 x 1.55: 1 4.5,0; 2 3.5,0; 3 2.5,0; 4 1.5,0; 5 0.5,0; 6 -0.5,0; 7 -1.5,0; 8 -2.5,0; 9 -3.5,0; 10 -4.5,0 | smd 1.2 x 1.8: M1 5.8,-2.525; M2 -5.8,-2.525

### Placement (x,y rotation side)
1C1  51.28,81.21 0 top
1C2  47.47,71.05 90 top
1C3  55.73,66.23 180 top
1C4  60.17,79.31 0 top
1C5  41.76,62.8 90 top
1C6  50.65,62.8 90 top
1D1  27.15,84.39 90 top
1OSC  46.2,62.16 0 top
1R1  30.33,84.39 90 top
1R2  30.96,80.58 0 top
1R3  30.96,78.04 180 top
1R4  44.3,67.24 180 top
1SW1  27.15,79.31 90 top
1U1  55.09,74.23 0 top
2C1  63.98,136.46 270 top
2C2  67.79,136.46 270 top
2C3  55.73,142.17 90 top
2C4  55.09,128.84 180 top
2C5  55.09,125.03 0 top
2D1  60.81,142.17 0 top
2L1  49.38,140.27 270 top
2R1  53.19,132.65 180 top
2R2  57.63,132.65 180 top
2U1  58.27,137.09 0 top
BATT_JN  76.35,154.35 270 top
D1  153.52,112.96 90 top
ESC1  50.02,56.08 0 top
ESC2  132.02,119.95 180 top
IMU  40.63,67.58 90 top
J1  96.37,40.57 0 top
J2  113.51,103.44 90 bottom
J3  84.94,158.05 0 top
J4  88.75,40.57 0 top
J5  84.94,146.44 0 top
J6  84.94,150.43 0 top
JP1  122.4,48.83 180 top
JP2  122.4,46.92 180 top
PCB1  62.02,131.57 270 top
R1  80.49,156.14 90 top
R2  80.49,152.33 270 top
R3  135.74,93.28 180 top
R4  135.74,96.45 180 top
R5  135.74,99.63 180 top
R6  44.3,72.32 0 top
R7  44.3,69.78 0 top
R8  135.74,102.8 180 top
R9  149.07,104.71 0 top
R10  149.07,107.25 0 top
R11  148.44,112.96 270 top
RPI_POWER  36.68,121.22 90 top
RPI_UART  145.26,104.71 90 top
S1  147.8,93.91 90 top
SWD  30.33,70.42 90 top
U2  32.48,87.69 0 top
U$1  131.81,82.66 90 top
U$2  92.56,35.49 0 top
U$3  34.14,70.42 0 top
U$4  29.06,123.76 0 top
X1  112.24,93.91 270 bottom

### Tracks (layer width: path | path; a pad name or v marks a point on that pad's centre or on a via)
3.3V  (via drill 0.35)
  Top 0.254: 120.75,46.92 JP2.2 | 135.1,104.71 135.1,103.02 R8.2 R5.2 R4.2 R3.2 | 150.34,109.79 150.34,107.67 R10.2 R9.2
  Top 0.762: J5.4 92.56,143.44 113.38,122.61 v113.38,116.77 113.64,116.52 J2.3 | v99.54,108.52 99.54,55.18 107.07,47.65 108.44,47.65 109.16,46.92 120.75,46.92 | v135.1,116.14 135.1,104.71 | v150.34,119.95 150.34,109.79
  Bottom 0.762: U$3.1 34.14,83.89 30.86,87.17 30.86,89.47 49.91,108.52 v99.54,108.52 J2.3 | v113.38,116.77 134.47,116.77 | 134.47,116.77 v135.1,116.14 | 134.47,116.77 136.37,116.77 139.55,119.95 v150.34,119.95
3.3V_MCU  (via drill 0.35)  (1 unrouted)
  Top 0.203: R6.2 45.61,72.78 | R7.2 45.57,70.2
  Top 0.254: 1C3.1 56.34,66.46 1U1.9 56.3,69.51 56.3,70.98 55.4,71.88 53.14,71.88 51.46,70.2 1C2.1 | 51.49,80.15 1C1.1 45.61,76.39 v45.61,75.55 | 51.49,80.15 52.34,79.3 1U1.36 | 1U1.24 59.85,77.4 v59.32,77.93 1C4.1 | 1C2.1 47.72,70.2 49,71.48 1U1.48 | 45.57,70.2 1C2.1 | 45.61,72.78 v45.61,73.55 | v46.33,69.27 47.26,70.2 1C2.1 | 1R2.2 40.58,80.58 IMU.6 | 51.49,80.15 v51.49,80.08
  Bottom 0.254: IMU.6 v45.61,75.55 v45.61,73.55 45.61,70 v46.33,69.27 44.21,71.39 40.35,71.39 39.38,70.42 34.77,70.42 | v51.49,80.08 57.17,80.08 v59.32,77.93 | U$3.2 34.77,70.42 | 34.92,74.15 35.41,73.66 35.41,71.05 34.77,70.42
3.3V_PROG
  Top 0.254: SWD.4 31.92,69.92 U$3.3
5V  (via drill 0.35)  (6 unrouted)
  Top 0.254: 120.75,48.83 JP1.2
  Top 0.508: 2C5.1 54.24,124.67
  Top 0.762: J5.5 95.1,143.44 v98.27,140.27 | v103.35,119.95 103.35,55.81 110.34,48.83 120.75,48.83
  Bottom 0.762: v98.27,140.27 98.2,140.19 56.92,140.19 v51.28,134.55 | v52.55,125.66 97.64,125.66 v103.35,119.95
  pour Top (isolate 0.305): 55.09,124.39 55.09,129.47 52.55,132.01 52.55,137.73 44.3,137.73 35.41,128.84 29.06,128.84 29.06,125.66 50.65,125.66 51.92,124.39
12V  (via drill 0.35)
  Top 0.254: BATT_JN.+ 79.54,157.95 R1.2
  Top 0.508: 2C2.1 76.26,137.31 77.32,138.36
  Top 2.54: BATT_JN.+ 72.24,153.83 72.24,149.16 77.32,144.08 77.32,138.36 v77.32,53.27 | ESC2.+ 134.52,130.69 107.16,158.05 J3.P$1 | v77.32,53.27 v79.22,53.27 v81.13,53.27 v83.67,53.27 | v77.32,53.27 v74.78,53.27 v72.24,53.27 v69.7,53.27
  Bottom 2.54: U$2.+ 96.37,35.7 J1.P$1 v83.67,53.27 v81.13,53.27 v79.22,53.27 v77.32,53.27 v74.78,53.27 v72.24,53.27 v69.7,53.27 48.74,53.27 47.52,54.5 ESC1.+ | BATT_JN.+ 76.45,158.05 J3.P$1
  pour Top (isolate 0.305): 60.17,137.09 68.04,137.09 68.04,138.11 67.92,138.23 67.66,138.49 63.47,138.49 60.17,138.49
33
  Top 0.254: 1U1.19 58.74,74.48 58.3,74.92 58.3,80.14 56.54,81.89 54.88,81.89 51.53,85.24 1R1.2
BATT_LVL  (via drill 0.35)
  Top 0.203: R1.1 R2.1
  Top 0.254: R2.1 82.4,151.28 82.4,144.71 107.16,119.95 107.16,85.66 108.43,84.39 v110.34,84.39 | v114.78,84.39 122.46,84.39 U$1.15/A1
  Bottom 0.254: v110.34,84.39 v114.78,84.39
BT_RX  (1 unrouted)
  Bottom 0.254: U$1.8 133.23,83.78 123.72,83.78 123.06,83.12 47.22,83.12
BT_TX  (1 unrouted)
  Bottom 0.254: U$1.7 132.92,81.54 123.72,81.54 122.78,82.48 45.06,82.48
DEBUG_RX
  Top 0.254: SWD.6 31.48,67.92 40.93,58.47 58.36,58.47 60.35,60.46 60.35,70.98 1U1.13
DEBUG_TX
  Top 0.254: SWD.5 31.12,68.92 39.41,60.63 50.85,60.63 55.55,65.34 57.2,65.34 57.84,65.97 1U1.12
GND  (via drill 0.35)  (120 unrouted)
  Top 0.203: 2D1.A 58.66,140.02 58.27,139.63 2U1.9 58.27,132.86 2R2.1 | 1U1.35 52.84,80.23 v53.69,81.08 | v61.95,76.64 61.79,76.48 1U1.23 | 1C3.2 54.88,67.03 v55.34,67.5 55.84,67.99 1U1.8 | 1U1.47 48.83,71.98 v48.61,72.19
  other vias: 31.47,76 36.55,76.64 28.55,86.16 53.69,74.73 56.23,74.73 50.52,65.21 45.31,77.27 80.24,135.69 62.46,133.15 152.63,102.67 106.27,61.4 96.11,61.4 96.11,90.61 38.07,71.56 38.71,69.02 43.03,64.07 42.14,67.62 148.44,117.41 151.61,115.5 151.61,110.42 80.24,133.79 80.24,131.88 80.24,129.98 80.24,137.6 82.14,137.6 82.14,135.69 82.14,133.79 82.14,131.88 82.14,129.98 64.36,132.52 66.27,133.15 68.17,133.15 69.44,134.42 96.11,92.51 96.11,94.42 96.11,96.32 96.11,98.23 98.02,90.61 98.02,92.51 98.02,94.42 98.02,96.32 98.02,98.23 96.11,63.3 96.11,65.21 96.11,67.11 96.11,69.02 96.11,70.92 98.02,70.92 98.02,61.4 98.02,63.3 98.02,65.21 98.02,67.11 98.02,69.02 106.27,63.3 106.27,65.21 106.27,67.11 106.27,69.02 106.27,70.92 108.18,70.92 108.18,69.02 108.18,67.11 108.18,65.21 108.18,63.3 108.18,61.4 36.55,78.54 38.45,78.54 38.45,76 37.18,74.1 29.56,74.73 28.29,72.19 28.29,69.65 39.22,63.43 51.79,65.84 56.23,72.83 53.69,73.46 61.95,75.37
  pour Top (isolate 0.305, rank 4): -0.15,187.89 180.19,187.89 180.19,-0.07 -0.15,-0.07
  pour Bottom (isolate 0.305, rank 4): 180.19,187.89 -0.15,187.89 -0.15,-0.07 180.19,-0.07
IMU_RST
  Top 0.254: IMU.1 41.3,68.51 50.01,68.51 50.82,67.7 52.18,67.7 52.84,68.36 1U1.2
IMU_SCL
  Top 0.254: IMU.3 43.11,72.66 R6.1 43.45,72.47 45.46,74.48 1U1.42
IMU_SDA
  Top 0.254: IMU.2 43.11,70.12 R7.1 43.45,70.41 44.53,71.49 45.83,71.49 46.03,71.68 46.03,72.48 47.53,73.98 1U1.43
INM1
  Bottom 0.254: X1.8 117.48,96.41 117.64,96.58 122.97,96.58 U$1.A21/DAC0
INM2
  Bottom 0.254: X1.6 118.02,94.41 118.28,94.67 122.34,94.67 U$1.A22/DAC1
INM3  (via drill 0.35)
  Top 0.254: v122.4,92.01 123.04,91.37 123.04,88.2 123.49,87.74 U$1.13/SCK
  Bottom 0.254: X1.4 118.56,92.41 118.91,92.77 121.64,92.77 v122.4,92.01
INM4  (via drill 0.35)
  Top 0.254: v122.28,90.1 122.28,87.11 U$1.14/A0
  Bottom 0.254: X1.2 121.97,90.41 v122.28,90.1
L1_RX  (via drill 0.35)
  Top 0.254: v119.23,111.28 118.82,110.87 118.82,110.12 117.56,108.86 v117.56,98.24
  Bottom 0.203: v119.23,111.28 121.08,113.14 U$1.33/A14
  Bottom 0.254: X1.9 116.73,97.41 v117.56,98.24
L1_TX  (via drill 0.35)
  Top 0.254: v116.69,98.99 116.69,109.15 v117.96,110.42
  Bottom 0.203: 124.01,110.42 U$1.34/A15
  Bottom 0.254: X1.10 116.11,98.41 v116.69,98.99 | v117.96,110.42 124.01,110.42
L3_RX  (via drill 0.35)
  Top 0.254: 1U1.31 54.84,80.88 v55.09,81.13
  Bottom 0.254: v55.09,81.13 55.82,81.87 117.36,81.87 123.07,76.16 124.65,76.16 125.3,75.5 125.3,73.92 U$1.1/TX
L3_TX  (via drill 0.35)
  Top 0.254: 1U1.30 55.34,80.19 v56.26,81.11
  Bottom 0.254: v56.26,81.11 115.58,81.11 123.07,73.62 124.65,73.62 125.3,72.96 125.3,71.38 U$1.0/RX
L4_RX  (via drill 0.35)
  Top 0.254: v109.7,86.29 109.07,86.93 109.07,121.85 87.48,143.44 J5.2
  Bottom 0.254: U$1.10/CS 134.99,82.66 131.33,86.32 123.72,86.32 123.7,86.29 v109.7,86.29
L4_TX
  Top 0.254: J5.3 91.84,144.73 91.84,143.15 111.61,123.39 111.61,85.66 116.02,81.24 124.65,81.24 125.77,80.12 U$1.9/CS
LIGHT_INT
  Bottom 0.254: U$1.39/A20 119.05,97.9 113.51,103.44 J2.1
N$1
  Top 0.254: JP1.1 122.81,53.34 U$1.VIN
N$2
  Top 0.254: JP2.1 122.81,47.41 125.3,49.9 125.3,58.68 U$1.3V3_LO
N$3
  Top 0.254: 1D1.A 30.3,83.51 1R1.1
N$4
  Top 0.254: 1SW1.P$1 29.13,77.06 1R3.2
N$5
  Top 0.254: S1.11 140.82,92.79 140.82,93.97 U$1.25 138.33,96.45 R4.1
N$6  (3 unrouted)
  pour Top (isolate 0.305): 60.17,139 62.71,139 63.98,140.27 63.98,145.35 49.38,145.35 49.38,142.81 59.54,142.81 60.17,142.17
N$7
  Top 0.254: 2R2.2 54.46,132.65 | 54.46,132.65 2R1.1 | 2U1.4 55.8,133.99 54.46,132.65
N$8
  Top 0.254: 2U1.1 55.8,141.25 2C3.1
N$9  (1 unrouted)
  Top 0.508: 36.5,123.76 RPI_POWER.2
N$10
  Top 0.254: S1.12 140.82,90.25 140.82,91.43 U$1.24 138.97,93.28 R3.1
N$11
  Top 0.254: S1.10 140.82,95.33 140.82,96.51 U$1.26 137.7,99.63 R5.1
N$12
  Top 0.254: S1.9 140.82,97.87 140.82,99.05 U$1.27 137.06,102.8 R8.1
N$13
  Top 0.254: RPI_UART.4 148.22,112.33 R11.2
N$14  (via drill 0.35)
  Top 0.254: R11.1 v148.44,115.5 | v152.25,112.33 153.27,112.33 D1.A
  Bottom 0.254: v148.44,115.5 149.07,115.5 v152.25,112.33
N$23  (via drill 0.35)
  Top 0.254: 1R4.1 45.4,67.5 v46.45,67.5 | v48.11,73.22 48.36,73.48 1U1.44
  Bottom 0.254: v46.45,67.5 46.45,67.69 47.09,68.32 47.09,72.2 v48.11,73.22
OSC_IN
  Top 0.254: 1C5.1 41.97,62.16 1OSC.P$2 49.43,67.24 53.22,67.24 54.34,68.36 1U1.5
OSC_OUT
  Top 0.254: 1OSC.P$1 50.43,62.16 1C6.1 50.65,62 53.31,64.66 53.31,66.61 54.84,68.14 1U1.6
PWMM1  (via drill 0.35)
  Top 0.254: v117.96,95.82 118.42,96.28 118.42,107.71 v118.59,107.88
  Bottom 0.254: X1.7 117.55,95.41 v117.96,95.82 | v118.59,107.88 118.77,108.06 U$1.35/A16
PWMM2  (via drill 0.35)
  Top 0.254: v118.59,93.91 119.23,94.55 v119.23,105.34
  Bottom 0.254: X1.5 118.09,93.41 v118.59,93.91 | v119.23,105.34 119.4,105.52 U$1.36/A17
PWMM3  (via drill 0.35)
  Top 0.254: v119.23,92.01 119.23,92.2 120.06,93.04 120.06,102.63 v120.75,103.31
  Bottom 0.254: X1.3 118.63,91.41 v119.23,92.01 | v120.75,103.31 123.86,103.31 U$1.37/A18
PWMM4  (via drill 0.35)
  Top 0.254: v119.86,89.47 120.62,90.23 120.62,92.33 120.65,92.36 120.65,100.41 v121.13,100.9
  Bottom 0.254: X1.1 119.81,89.41 v119.86,89.47 | v121.13,100.9 123.73,100.9 U$1.38/A19
RESET  (via drill 0.35)
  Top 0.254: 1SW1.P$2 29.13,81.56 1R2.1 31.08,81.55 41.41,81.55 43.65,79.31 v46.84,79.31 | 1U1.7 55.34,70.87 v55.09,71.12
  Bottom 0.254: v55.09,71.12 55.09,78.35 53.82,79.62 52.11,79.62 51.8,79.32 46.85,79.32 v46.84,79.31
RPI_1
  Top 0.254: S1.7 143.5,105.23 RPI_UART.2 R10.1
RPI_2
  Top 0.254: S1.8 145.26,99.48 RPI_UART.1 R9.1
RPI_RX
  Bottom 0.254: U$1.32/A13 141.15,114.87 RPI_UART.5
RPI_TX  (via drill 0.35)
  Top 0.254: U$1.31/A12 140.82,111.99 v140.82,116.77
  Bottom 0.254: v140.82,116.77 141.45,117.41 RPI_UART.6
SWDCLK  (via drill 0.35)
  Top 0.254: SWD.2 33.56,71.92 33.61,71.86 34.48,71.86 35.41,70.94 35.41,70.42 39.96,65.86 46.2,65.86 46.43,66.1 v46.43,66.37 | v51.98,76.77 51.77,76.98 1U1.37
  Bottom 0.254: v46.43,66.37 46.43,66.4 47.59,67.56 47.59,68.64 51.98,73.02 v51.98,76.77
SWDIO  (via drill 0.35)
  Top 0.254: 1U1.34 v53.34,77.27 | v46.22,65.11 46.14,65.03 40.15,65.03 36.03,69.15 33.61,69.15 31.84,70.92 SWD.3
  Bottom 0.254: v46.22,65.11 46.37,65.11 48.09,66.83 48.09,68.49 52.55,72.94 52.55,76.26 53.34,77.05 v53.34,77.27

### Text on the board
tPlace: 12v | gnd | gnd | rx | tx | 3v3 | 5v | on | 5v | off | gnd | tx | rx | led | dip1 | dip2 | 3v3 | gnd | tx | rx | 3v3 | gnd | scl | sda | rst | prog / power | 5v | 3v3 | gnd | 12v
bPlace: 3v3 | gnd | light / int